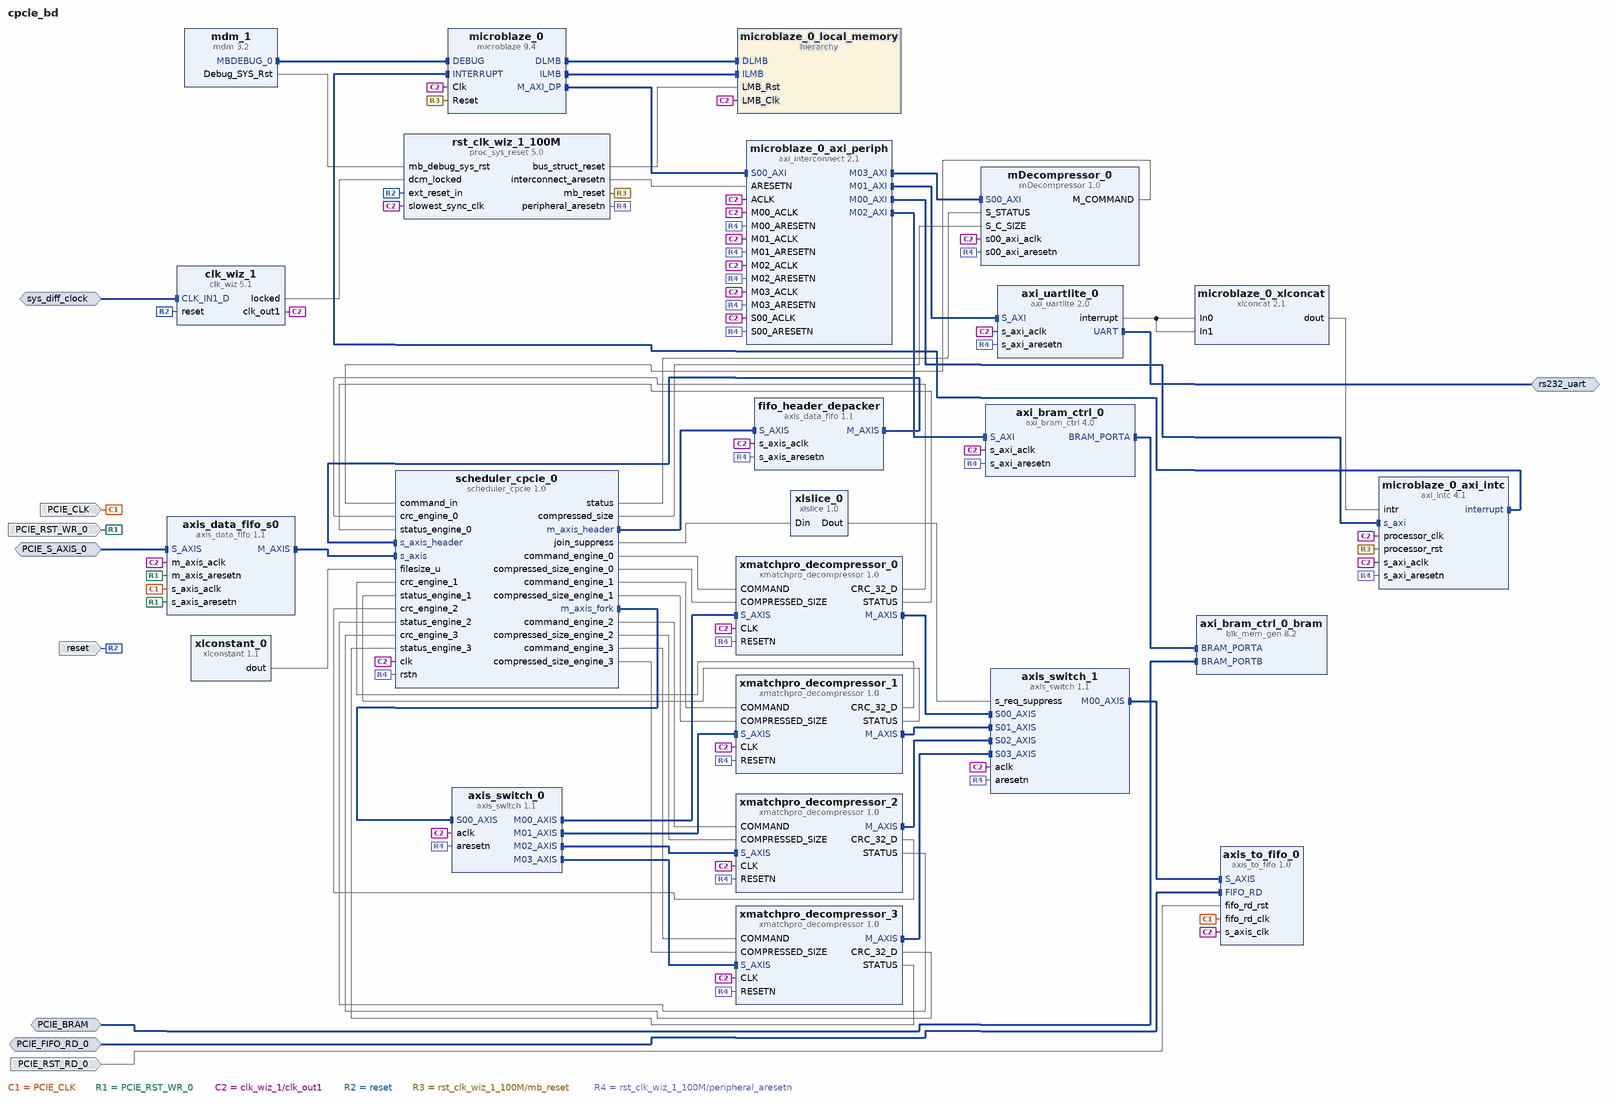
[diagram p0: block diagram of the top level]
# Vivado block design cpcie_bd, Vivado 2014.4
create_bd_design cpcie_bd

create_bd_intf_port -mode Slave -vlnv xilinx.com:interface:bram_rtl:1.0 PCIE_BRAM
create_bd_intf_port -mode Slave -vlnv xilinx.com:interface:fifo_read_rtl:1.0 PCIE_FIFO_RD_0
create_bd_intf_port -mode Slave -vlnv xilinx.com:interface:axis_rtl:1.0 PCIE_S_AXIS_0
set_property -dict [list \
  CONFIG.TDATA_NUM_BYTES 4 \
  CONFIG.TDEST_WIDTH 0 \
  CONFIG.TID_WIDTH 0 \
  CONFIG.TUSER_WIDTH 0 \
  CONFIG.HAS_TREADY 1 \
  CONFIG.HAS_TSTRB 0 \
  CONFIG.HAS_TKEEP 0 \
  CONFIG.HAS_TLAST 1 \
  CONFIG.FREQ_HZ 100000000 \
  CONFIG.PHASE 0.000 \
  CONFIG.LAYERED_METADATA undef \
] [get_bd_intf_ports PCIE_S_AXIS_0]
create_bd_intf_port -mode Master -vlnv xilinx.com:interface:uart_rtl:1.0 rs232_uart
create_bd_intf_port -mode Slave -vlnv xilinx.com:interface:diff_clock_rtl:1.0 sys_diff_clock
set_property -dict {CONFIG.FREQ_HZ 200000000} [get_bd_intf_ports sys_diff_clock]
create_bd_port -dir I -type clk PCIE_CLK
set_property -dict [list \
  CONFIG.ASSOCIATED_BUSIF PCIE_S_AXIS_0:PCIE_S_AXIS_0_1:PCIE_M_AXIS_0:PCIE_M_AXIS_1:PCIE_S_AXIS_1 \
] [get_bd_ports PCIE_CLK]
create_bd_port -dir I -type rst PCIE_RST_RD_0
create_bd_port -dir I -type rst PCIE_RST_WR_0
create_bd_port -dir I -type rst reset
set_property -dict {CONFIG.POLARITY ACTIVE_HIGH} [get_bd_ports reset]

create_bd_cell -type ip -vlnv xilinx.com:ip:axi_bram_ctrl:4.0 axi_bram_ctrl_0
set_property -dict {CONFIG.PROTOCOL AXI4LITE CONFIG.SINGLE_PORT_BRAM 1} [get_bd_cells axi_bram_ctrl_0]
create_bd_cell -type ip -vlnv xilinx.com:ip:blk_mem_gen:8.2 axi_bram_ctrl_0_bram
set_property -dict [list \
  CONFIG.Memory_Type True_Dual_Port_RAM \
  CONFIG.Enable_32bit_Address true \
  CONFIG.Write_Depth_A 32 \
  CONFIG.Enable_B Use_ENB_Pin \
  CONFIG.Register_PortA_Output_of_Memory_Primitives false \
  CONFIG.Register_PortB_Output_of_Memory_Primitives false \
  CONFIG.Use_RSTA_Pin true \
  CONFIG.Use_RSTB_Pin false \
  CONFIG.Port_B_Clock 100 \
  CONFIG.Port_B_Write_Rate 50 \
  CONFIG.Port_B_Enable_Rate 100 \
  CONFIG.use_bram_block Stand_Alone \
] [get_bd_cells axi_bram_ctrl_0_bram]
create_bd_cell -type ip -vlnv xilinx.com:ip:axi_uartlite:2.0 axi_uartlite_0
set_property -dict [list \
  CONFIG.C_BAUDRATE 115200 \
  CONFIG.USE_BOARD_FLOW true \
  CONFIG.UARTLITE_BOARD_INTERFACE rs232_uart \
] [get_bd_cells axi_uartlite_0]
create_bd_cell -type ip -vlnv xilinx.com:ip:axis_data_fifo:1.1 axis_data_fifo_s0
set_property -dict [list \
  CONFIG.TDATA_NUM_BYTES 4 \
  CONFIG.FIFO_DEPTH 1024 \
  CONFIG.IS_ACLK_ASYNC 1 \
  CONFIG.HAS_TLAST 1 \
  CONFIG.SYNCHRONIZATION_STAGES 3 \
] [get_bd_cells axis_data_fifo_s0]
create_bd_cell -type ip -vlnv mohdazainol:user_ip:axis_to_fifo:1.0 axis_to_fifo_0
create_bd_cell -type ip -vlnv xilinx.com:ip:clk_wiz:5.1 clk_wiz_1
set_property -dict [list \
  CONFIG.USE_BOARD_FLOW true \
  CONFIG.CLK_IN1_BOARD_INTERFACE sys_diff_clock \
  CONFIG.RESET_BOARD_INTERFACE reset \
] [get_bd_cells clk_wiz_1]
create_bd_cell -type ip -vlnv mohdazainol:user_ip:mDecompressor:1.0 mDecompressor_0
create_bd_cell -type ip -vlnv xilinx.com:ip:mdm:3.2 mdm_1
create_bd_cell -type ip -vlnv xilinx.com:ip:microblaze:9.4 microblaze_0
set_property -dict {CONFIG.C_D_AXI 1 CONFIG.C_D_LMB 1 CONFIG.C_I_LMB 1 CONFIG.C_DEBUG_ENABLED 1} [get_bd_cells microblaze_0]
create_bd_cell -type ip -vlnv xilinx.com:ip:axi_intc:4.1 microblaze_0_axi_intc
set_property -dict {CONFIG.C_HAS_FAST 1} [get_bd_cells microblaze_0_axi_intc]
create_bd_cell -type ip -vlnv xilinx.com:ip:axi_interconnect:2.1 microblaze_0_axi_periph
set_property -dict {CONFIG.NUM_MI 4} [get_bd_cells microblaze_0_axi_periph]
create_bd_cell -type hier microblaze_0_local_memory
create_bd_cell -type ip -vlnv xilinx.com:ip:xlconcat:2.1 microblaze_0_xlconcat
create_bd_cell -type ip -vlnv xilinx.com:ip:proc_sys_reset:5.0 rst_clk_wiz_1_100M
set_property -dict {CONFIG.USE_BOARD_FLOW true CONFIG.RESET_BOARD_INTERFACE reset} [get_bd_cells rst_clk_wiz_1_100M]
create_bd_cell -type ip -vlnv xilinx.com:ip:axis_switch:1.1 axis_switch_0
set_property -dict [list \
  CONFIG.NUM_SI 1 \
  CONFIG.NUM_MI 4 \
  CONFIG.TDATA_NUM_BYTES 4 \
  CONFIG.TDEST_WIDTH 4 \
  CONFIG.DECODER_REG 1 \
  CONFIG.M00_AXIS_BASETDEST 0x00000001 \
  CONFIG.M01_AXIS_BASETDEST 0x00000002 \
  CONFIG.M02_AXIS_BASETDEST 0x00000004 \
  CONFIG.M03_AXIS_BASETDEST 0x00000008 \
  CONFIG.M00_AXIS_HIGHTDEST 0x00000001 \
  CONFIG.M01_AXIS_HIGHTDEST 0x00000002 \
  CONFIG.M02_AXIS_HIGHTDEST 0x00000004 \
  CONFIG.M03_AXIS_HIGHTDEST 0x00000008 \
] [get_bd_cells axis_switch_0]
create_bd_cell -type ip -vlnv xilinx.com:ip:axis_switch:1.1 axis_switch_1
set_property -dict [list \
  CONFIG.NUM_SI 4 \
  CONFIG.TDATA_NUM_BYTES 4 \
  CONFIG.TDEST_WIDTH 0 \
  CONFIG.ARB_ON_MAX_XFERS 1024 \
  CONFIG.ARB_ON_NUM_CYCLES 1 \
  CONFIG.ARB_ALGORITHM 1 \
] [get_bd_cells axis_switch_1]
create_bd_cell -type ip -vlnv xilinx.com:ip:axis_data_fifo:1.1 fifo_header_depacker
set_property -dict {CONFIG.TDATA_NUM_BYTES 4 CONFIG.FIFO_DEPTH 8192} [get_bd_cells fifo_header_depacker]
create_bd_cell -type ip -vlnv mohdazainol:user_ip:scheduler_cpcie:1.0 scheduler_cpcie_0
create_bd_cell -type ip -vlnv xilinx.com:ip:xlconstant:1.1 xlconstant_0
set_property -dict {CONFIG.CONST_WIDTH 32} [get_bd_cells xlconstant_0]
create_bd_cell -type ip -vlnv xilinx.com:ip:xlslice:1.0 xlslice_0
set_property -dict {CONFIG.DIN_FROM 3 CONFIG.DIN_WIDTH 5} [get_bd_cells xlslice_0]
create_bd_cell -type ip -vlnv mohdazainol:user_ip:xmatchpro_decompressor:1.0 xmatchpro_decompressor_0
create_bd_cell -type ip -vlnv mohdazainol:user_ip:xmatchpro_decompressor:1.0 xmatchpro_decompressor_1
create_bd_cell -type ip -vlnv mohdazainol:user_ip:xmatchpro_decompressor:1.0 xmatchpro_decompressor_2
create_bd_cell -type ip -vlnv mohdazainol:user_ip:xmatchpro_decompressor:1.0 xmatchpro_decompressor_3

# ---- hierarchy /microblaze_0_local_memory ----
current_bd_instance /microblaze_0_local_memory
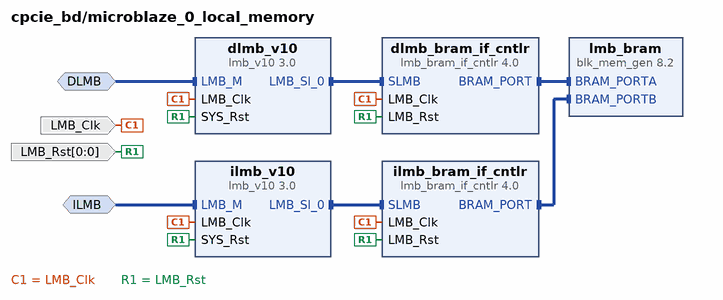
[diagram p1: block diagram inside /microblaze_0_local_memory]
create_bd_intf_pin -mode MirroredMaster -vlnv xilinx.com:interface:lmb_rtl:1.0 DLMB
create_bd_intf_pin -mode MirroredMaster -vlnv xilinx.com:interface:lmb_rtl:1.0 ILMB
create_bd_pin -dir I -type clk LMB_Clk
create_bd_pin -dir I -from 0 -to 0 -type rst LMB_Rst

create_bd_cell -type ip -vlnv xilinx.com:ip:lmb_bram_if_cntlr:4.0 dlmb_bram_if_cntlr
set_property -dict {CONFIG.C_ECC 0} [get_bd_cells dlmb_bram_if_cntlr]
create_bd_cell -type ip -vlnv xilinx.com:ip:lmb_v10:3.0 dlmb_v10
create_bd_cell -type ip -vlnv xilinx.com:ip:lmb_bram_if_cntlr:4.0 ilmb_bram_if_cntlr
set_property -dict {CONFIG.C_ECC 0} [get_bd_cells ilmb_bram_if_cntlr]
create_bd_cell -type ip -vlnv xilinx.com:ip:lmb_v10:3.0 ilmb_v10
create_bd_cell -type ip -vlnv xilinx.com:ip:blk_mem_gen:8.2 lmb_bram
set_property -dict {CONFIG.Memory_Type True_Dual_Port_RAM CONFIG.use_bram_block BRAM_Controller} [get_bd_cells lmb_bram]

# ---- connections ----

current_bd_instance /microblaze_0_local_memory
connect_bd_intf_net -intf_net microblaze_0_dlmb_bus [get_bd_intf_pins dlmb_bram_if_cntlr/SLMB] [get_bd_intf_pins dlmb_v10/LMB_Sl_0]
connect_bd_intf_net -intf_net microblaze_0_dlmb_cntlr [get_bd_intf_pins dlmb_bram_if_cntlr/BRAM_PORT] [get_bd_intf_pins lmb_bram/BRAM_PORTA]
connect_bd_intf_net -intf_net microblaze_0_ilmb_bus [get_bd_intf_pins ilmb_bram_if_cntlr/SLMB] [get_bd_intf_pins ilmb_v10/LMB_Sl_0]
connect_bd_intf_net -intf_net microblaze_0_ilmb_cntlr [get_bd_intf_pins ilmb_bram_if_cntlr/BRAM_PORT] [get_bd_intf_pins lmb_bram/BRAM_PORTB]
connect_bd_intf_net -intf_net microblaze_0_dlmb [get_bd_intf_pins DLMB] [get_bd_intf_pins dlmb_v10/LMB_M]
connect_bd_intf_net -intf_net microblaze_0_ilmb [get_bd_intf_pins ILMB] [get_bd_intf_pins ilmb_v10/LMB_M]
connect_bd_net -net microblaze_0_Clk [get_bd_pins LMB_Clk] \
  [get_bd_pins dlmb_bram_if_cntlr/LMB_Clk] [get_bd_pins dlmb_v10/LMB_Clk] [get_bd_pins ilmb_bram_if_cntlr/LMB_Clk] \
  [get_bd_pins ilmb_v10/LMB_Clk]
connect_bd_net -net microblaze_0_LMB_Rst [get_bd_pins LMB_Rst] \
  [get_bd_pins dlmb_bram_if_cntlr/LMB_Rst] [get_bd_pins dlmb_v10/SYS_Rst] [get_bd_pins ilmb_bram_if_cntlr/LMB_Rst] \
  [get_bd_pins ilmb_v10/SYS_Rst]

current_bd_instance /
connect_bd_intf_net [get_bd_intf_pins axi_bram_ctrl_0/BRAM_PORTA] [get_bd_intf_pins axi_bram_ctrl_0_bram/BRAM_PORTA]
connect_bd_intf_net -intf_net microblaze_0_axi_dp [get_bd_intf_pins microblaze_0/M_AXI_DP] [get_bd_intf_pins microblaze_0_axi_periph/S00_AXI]
connect_bd_intf_net [get_bd_intf_pins axi_uartlite_0/S_AXI] [get_bd_intf_pins microblaze_0_axi_periph/M01_AXI]
connect_bd_intf_net [get_bd_intf_pins axi_bram_ctrl_0/S_AXI] [get_bd_intf_pins microblaze_0_axi_periph/M02_AXI]
connect_bd_intf_net [get_bd_intf_pins mDecompressor_0/S00_AXI] [get_bd_intf_pins microblaze_0_axi_periph/M03_AXI]
connect_bd_intf_net [get_bd_intf_pins mdm_1/MBDEBUG_0] [get_bd_intf_pins microblaze_0/DEBUG]
connect_bd_intf_net [get_bd_intf_pins microblaze_0/DLMB] [get_bd_intf_pins microblaze_0_local_memory/DLMB]
connect_bd_intf_net [get_bd_intf_pins microblaze_0/ILMB] [get_bd_intf_pins microblaze_0_local_memory/ILMB]
connect_bd_intf_net -intf_net microblaze_0_intc_axi [get_bd_intf_pins microblaze_0_axi_intc/s_axi] [get_bd_intf_pins microblaze_0_axi_periph/M00_AXI]
connect_bd_intf_net [get_bd_intf_pins microblaze_0/INTERRUPT] [get_bd_intf_pins microblaze_0_axi_intc/interrupt]
connect_bd_intf_net -intf_net axis_data_fifo_0_M_AXIS [get_bd_intf_pins fifo_header_depacker/M_AXIS] [get_bd_intf_pins scheduler_cpcie_0/s_axis_header]
connect_bd_intf_net [get_bd_intf_pins axis_switch_0/M00_AXIS] [get_bd_intf_pins xmatchpro_decompressor_0/S_AXIS]
connect_bd_intf_net [get_bd_intf_pins axis_switch_0/M01_AXIS] [get_bd_intf_pins xmatchpro_decompressor_1/S_AXIS]
connect_bd_intf_net [get_bd_intf_pins axis_switch_0/M02_AXIS] [get_bd_intf_pins xmatchpro_decompressor_2/S_AXIS]
connect_bd_intf_net [get_bd_intf_pins axis_switch_0/M03_AXIS] [get_bd_intf_pins xmatchpro_decompressor_3/S_AXIS]
connect_bd_intf_net [get_bd_intf_pins axis_switch_0/S00_AXIS] [get_bd_intf_pins scheduler_cpcie_0/m_axis_fork]
connect_bd_intf_net [get_bd_intf_pins fifo_header_depacker/S_AXIS] [get_bd_intf_pins scheduler_cpcie_0/m_axis_header]
connect_bd_intf_net [get_bd_intf_pins axis_switch_1/S00_AXIS] [get_bd_intf_pins xmatchpro_decompressor_0/M_AXIS]
connect_bd_intf_net [get_bd_intf_pins axis_switch_1/S01_AXIS] [get_bd_intf_pins xmatchpro_decompressor_1/M_AXIS]
connect_bd_intf_net [get_bd_intf_pins axis_switch_1/S02_AXIS] [get_bd_intf_pins xmatchpro_decompressor_2/M_AXIS]
connect_bd_intf_net [get_bd_intf_pins axis_switch_1/S03_AXIS] [get_bd_intf_pins xmatchpro_decompressor_3/M_AXIS]
connect_bd_intf_net [get_bd_intf_pins scheduler_cpcie_0/s_axis] [get_bd_intf_pins axis_data_fifo_s0/M_AXIS]
connect_bd_intf_net [get_bd_intf_pins axis_switch_1/M00_AXIS] [get_bd_intf_pins axis_to_fifo_0/S_AXIS]
connect_bd_intf_net [get_bd_intf_ports PCIE_BRAM] [get_bd_intf_pins axi_bram_ctrl_0_bram/BRAM_PORTB]
connect_bd_intf_net [get_bd_intf_ports PCIE_FIFO_RD_0] [get_bd_intf_pins axis_to_fifo_0/FIFO_RD]
connect_bd_intf_net [get_bd_intf_ports PCIE_S_AXIS_0] [get_bd_intf_pins axis_data_fifo_s0/S_AXIS]
connect_bd_intf_net [get_bd_intf_ports rs232_uart] [get_bd_intf_pins axi_uartlite_0/UART]
connect_bd_intf_net [get_bd_intf_ports sys_diff_clock] [get_bd_intf_pins clk_wiz_1/CLK_IN1_D]
connect_bd_net [get_bd_ports PCIE_CLK] [get_bd_pins axis_data_fifo_s0/s_axis_aclk] [get_bd_pins axis_to_fifo_0/fifo_rd_clk]
connect_bd_net -net PCIE_RST_0_1 [get_bd_ports PCIE_RST_RD_0] [get_bd_pins axis_to_fifo_0/fifo_rd_rst]
connect_bd_net -net PCIE_RST_N_0_1 [get_bd_ports PCIE_RST_WR_0] \
  [get_bd_pins axis_data_fifo_s0/m_axis_aresetn] [get_bd_pins axis_data_fifo_s0/s_axis_aresetn]
connect_bd_net [get_bd_pins axi_uartlite_0/interrupt] [get_bd_pins microblaze_0_xlconcat/In0] [get_bd_pins microblaze_0_xlconcat/In1]
connect_bd_net [get_bd_pins clk_wiz_1/locked] [get_bd_pins rst_clk_wiz_1_100M/dcm_locked]
connect_bd_net [get_bd_pins mdm_1/Debug_SYS_Rst] [get_bd_pins rst_clk_wiz_1_100M/mb_debug_sys_rst]
connect_bd_net -net microblaze_0_Clk [get_bd_pins clk_wiz_1/clk_out1] \
  [get_bd_pins axi_bram_ctrl_0/s_axi_aclk] [get_bd_pins axi_uartlite_0/s_axi_aclk] \
  [get_bd_pins axis_data_fifo_s0/m_axis_aclk] [get_bd_pins axis_to_fifo_0/s_axis_clk] \
  [get_bd_pins mDecompressor_0/s00_axi_aclk] [get_bd_pins microblaze_0/Clk] [get_bd_pins microblaze_0_axi_intc/processor_clk] \
  [get_bd_pins microblaze_0_axi_intc/s_axi_aclk] [get_bd_pins microblaze_0_axi_periph/ACLK] \
  [get_bd_pins microblaze_0_axi_periph/M00_ACLK] [get_bd_pins microblaze_0_axi_periph/M01_ACLK] \
  [get_bd_pins microblaze_0_axi_periph/M02_ACLK] [get_bd_pins microblaze_0_axi_periph/M03_ACLK] \
  [get_bd_pins microblaze_0_axi_periph/S00_ACLK] [get_bd_pins microblaze_0_local_memory/LMB_Clk] \
  [get_bd_pins rst_clk_wiz_1_100M/slowest_sync_clk] [get_bd_pins fifo_header_depacker/s_axis_aclk] \
  [get_bd_pins scheduler_cpcie_0/clk] [get_bd_pins axis_switch_0/aclk] [get_bd_pins xmatchpro_decompressor_2/CLK] \
  [get_bd_pins xmatchpro_decompressor_3/CLK] [get_bd_pins xmatchpro_decompressor_1/CLK] \
  [get_bd_pins xmatchpro_decompressor_0/CLK] [get_bd_pins axis_switch_1/aclk]
connect_bd_net -net microblaze_0_intr [get_bd_pins microblaze_0_xlconcat/dout] [get_bd_pins microblaze_0_axi_intc/intr]
connect_bd_net [get_bd_ports reset] [get_bd_pins clk_wiz_1/reset] [get_bd_pins rst_clk_wiz_1_100M/ext_reset_in]
connect_bd_net [get_bd_pins rst_clk_wiz_1_100M/bus_struct_reset] [get_bd_pins microblaze_0_local_memory/LMB_Rst]
connect_bd_net [get_bd_pins rst_clk_wiz_1_100M/interconnect_aresetn] [get_bd_pins microblaze_0_axi_periph/ARESETN]
connect_bd_net [get_bd_pins rst_clk_wiz_1_100M/mb_reset] [get_bd_pins microblaze_0/Reset] [get_bd_pins microblaze_0_axi_intc/processor_rst]
connect_bd_net [get_bd_pins rst_clk_wiz_1_100M/peripheral_aresetn] \
  [get_bd_pins axi_bram_ctrl_0/s_axi_aresetn] [get_bd_pins axi_uartlite_0/s_axi_aresetn] \
  [get_bd_pins mDecompressor_0/s00_axi_aresetn] [get_bd_pins microblaze_0_axi_intc/s_axi_aresetn] \
  [get_bd_pins microblaze_0_axi_periph/M00_ARESETN] [get_bd_pins microblaze_0_axi_periph/M01_ARESETN] \
  [get_bd_pins microblaze_0_axi_periph/M02_ARESETN] [get_bd_pins microblaze_0_axi_periph/M03_ARESETN] \
  [get_bd_pins microblaze_0_axi_periph/S00_ARESETN] [get_bd_pins fifo_header_depacker/s_axis_aresetn] \
  [get_bd_pins scheduler_cpcie_0/rstn] [get_bd_pins axis_switch_0/aresetn] [get_bd_pins xmatchpro_decompressor_0/RESETN] \
  [get_bd_pins xmatchpro_decompressor_1/RESETN] [get_bd_pins xmatchpro_decompressor_2/RESETN] \
  [get_bd_pins xmatchpro_decompressor_3/RESETN] [get_bd_pins axis_switch_1/aresetn]
connect_bd_net [get_bd_pins scheduler_cpcie_0/command_engine_0] [get_bd_pins xmatchpro_decompressor_0/COMMAND]
connect_bd_net [get_bd_pins scheduler_cpcie_0/command_engine_1] [get_bd_pins xmatchpro_decompressor_1/COMMAND]
connect_bd_net [get_bd_pins scheduler_cpcie_0/command_engine_2] [get_bd_pins xmatchpro_decompressor_2/COMMAND]
connect_bd_net [get_bd_pins scheduler_cpcie_0/command_engine_3] [get_bd_pins xmatchpro_decompressor_3/COMMAND]
connect_bd_net [get_bd_pins scheduler_cpcie_0/compressed_size_engine_0] [get_bd_pins xmatchpro_decompressor_0/COMPRESSED_SIZE]
connect_bd_net [get_bd_pins scheduler_cpcie_0/compressed_size_engine_1] [get_bd_pins xmatchpro_decompressor_1/COMPRESSED_SIZE]
connect_bd_net [get_bd_pins scheduler_cpcie_0/compressed_size_engine_2] [get_bd_pins xmatchpro_decompressor_2/COMPRESSED_SIZE]
connect_bd_net [get_bd_pins scheduler_cpcie_0/compressed_size_engine_3] [get_bd_pins xmatchpro_decompressor_3/COMPRESSED_SIZE]
connect_bd_net [get_bd_pins scheduler_cpcie_0/join_suppress] [get_bd_pins xlslice_0/Din]
connect_bd_net [get_bd_pins xlconstant_0/dout] [get_bd_pins scheduler_cpcie_0/filesize_u]
connect_bd_net [get_bd_pins xlslice_0/Dout] [get_bd_pins axis_switch_1/s_req_suppress]
connect_bd_net [get_bd_pins xmatchpro_decompressor_0/CRC_32_D] [get_bd_pins scheduler_cpcie_0/crc_engine_0]
connect_bd_net [get_bd_pins xmatchpro_decompressor_0/STATUS] [get_bd_pins scheduler_cpcie_0/status_engine_0]
connect_bd_net [get_bd_pins xmatchpro_decompressor_1/CRC_32_D] [get_bd_pins scheduler_cpcie_0/crc_engine_1]
connect_bd_net [get_bd_pins xmatchpro_decompressor_1/STATUS] [get_bd_pins scheduler_cpcie_0/status_engine_1]
connect_bd_net [get_bd_pins xmatchpro_decompressor_2/CRC_32_D] [get_bd_pins scheduler_cpcie_0/crc_engine_2]
connect_bd_net [get_bd_pins xmatchpro_decompressor_2/STATUS] [get_bd_pins scheduler_cpcie_0/status_engine_2]
connect_bd_net [get_bd_pins xmatchpro_decompressor_3/CRC_32_D] [get_bd_pins scheduler_cpcie_0/crc_engine_3]
connect_bd_net [get_bd_pins xmatchpro_decompressor_3/STATUS] [get_bd_pins scheduler_cpcie_0/status_engine_3]
connect_bd_net [get_bd_pins mDecompressor_0/M_COMMAND] [get_bd_pins scheduler_cpcie_0/command_in]
connect_bd_net [get_bd_pins scheduler_cpcie_0/status] [get_bd_pins mDecompressor_0/S_STATUS]
connect_bd_net [get_bd_pins scheduler_cpcie_0/compressed_size] [get_bd_pins mDecompressor_0/S_C_SIZE]

# ---- address map ----
assign_bd_address -offset 0x0 -range 32K -target_address_space [get_bd_addr_spaces microblaze_0/Data] [get_bd_addr_segs microblaze_0_local_memory/dlmb_bram_if_cntlr/SLMB/Mem]
assign_bd_address -offset 0x40600000 -range 64K -target_address_space [get_bd_addr_spaces microblaze_0/Data] [get_bd_addr_segs axi_uartlite_0/S_AXI/Reg]
assign_bd_address -offset 0x41200000 -range 64K -target_address_space [get_bd_addr_spaces microblaze_0/Data] [get_bd_addr_segs microblaze_0_axi_intc/s_axi/Reg]
assign_bd_address -offset 0x44A00000 -range 64K -target_address_space [get_bd_addr_spaces microblaze_0/Data] [get_bd_addr_segs mDecompressor_0/S00_AXI/S00_AXI_reg]
assign_bd_address -offset 0xC0000000 -range 8K -target_address_space [get_bd_addr_spaces microblaze_0/Data] [get_bd_addr_segs axi_bram_ctrl_0/S_AXI/Mem0]
assign_bd_address -offset 0x0 -range 32K -target_address_space [get_bd_addr_spaces microblaze_0/Instruction] [get_bd_addr_segs microblaze_0_local_memory/ilmb_bram_if_cntlr/SLMB/Mem]

validate_bd_design
save_bd_design
